# EAGLE schematic scratchpad (EAGLE 7.2.0)
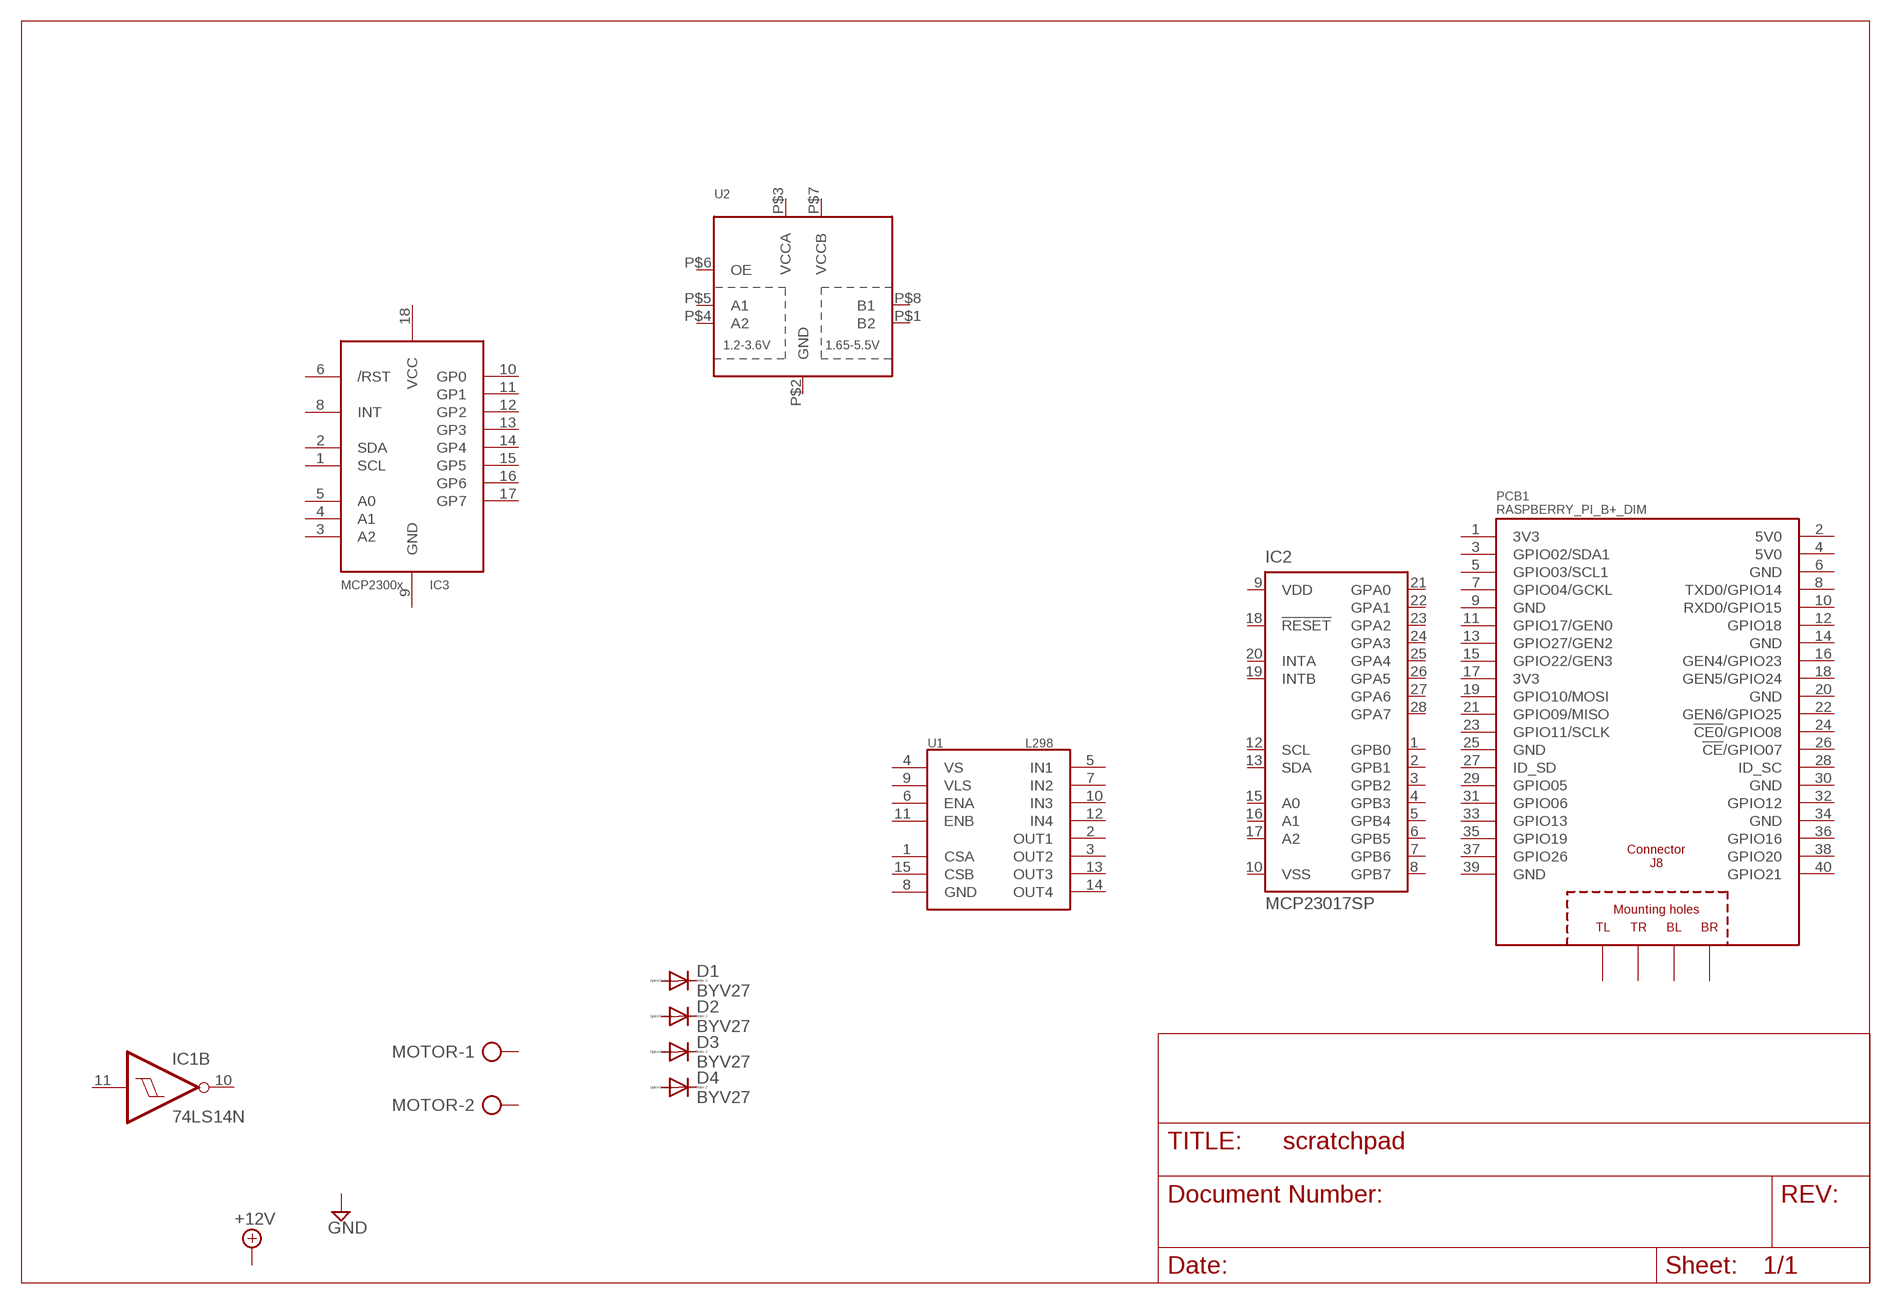
[diagram p0: schematic, sheet 1]

## Parts
D1  BYV27  [SOD57-10]
D2  BYV27  [SOD57-10]
D3  BYV27  [SOD57-10]
D4  BYV27  [SOD57-10]
IC1  74LS14N  [DIL14]
IC2  MCP23017SP  [DIL28-3]
IC3  MCP2300X/P  [DIL18]
MOTOR  AK500/2-H  [AK500/2-H]
PCB1  RASPBERRY_PI_B+_DIM  [RASPBERRY_PI_BPLUS_DIM]
U1  L298  [MULTIWATT15]
U2  TXS0102  [VFSOP-8]
Unconnected: D1.A D1.C D2.A D2.C D3.A D3.C D4.A D4.C IC1.1(D:I) IC1.2(D:O) IC1.3(E:I) IC1.4(E:O) IC1.5(F:I) IC1.6(F:O) IC1.8(C:O) IC1.9(C:I) IC1.10(B:O) IC1.11(B:I) IC1.12(A:O) IC1.13(A:I) IC2.1(GPB0) IC2.2(GPB1) IC2.3(GPB2) IC2.4(GPB3) IC2.5(GPB4) IC2.6(GPB5) IC2.7(GPB6) IC2.8(GPB7) IC2.12(SCL) IC2.13(SDA) IC2.15(A0) IC2.16(A1) IC2.17(A2) IC2.18(!RESET) IC2.19(INTB) IC2.20(INTA) IC2.21(GPA0) IC2.22(GPA1) IC2.23(GPA2) IC2.24(GPA3) IC2.25(GPA4) IC2.26(GPA5) IC2.27(GPA6) IC2.28(GPA7) IC3.1(SCL) IC3.2(SDA) IC3.3(A2) IC3.4(A1) IC3.5(A0) IC3.6(/RST) IC3.8(INT) IC3.10(GP0) IC3.11(GP1) IC3.12(GP2) IC3.13(GP3) IC3.14(GP4) IC3.15(GP5) IC3.16(GP6) IC3.17(GP7) MOTOR.1 MOTOR.2 PCB1.3(GPIO02/SDA1) PCB1.5(GPIO03/SCL1) PCB1.7(GPIO04/GCKL) PCB1.8(TXD0/GPIO14) PCB1.10(RXD0/GPIO15) PCB1.11(GPIO17/GEN0) PCB1.12(GPIO18) PCB1.13(GPIO27/GEN2) PCB1.15(GPIO22/GEN3) PCB1.16(GEN4/GPIO23) PCB1.18(GEN5/GPIO24) PCB1.19(GPIO10/MOSI) PCB1.21(GPIO09/MISO) PCB1.22(GEN6/GPIO25) PCB1.23(GPIO11/SCLK) PCB1.24(!CE0!/GPIO08) PCB1.26(!CE!/GPIO07) PCB1.27(ID_SD) PCB1.28(ID_SC) PCB1.29(GPIO05) PCB1.31(GPIO06) PCB1.32(GPIO12) PCB1.33(GPIO13) PCB1.35(GPIO19) PCB1.36(GPIO16) PCB1.37(GPIO26) PCB1.38(GPIO20) PCB1.40(GPIO21) PCB1.PE_BL(BL) PCB1.PE_BR(BR) PCB1.PE_TL(TL) PCB1.PE_TR(TR) U1.1(CSA) U1.2(OUT1) U1.3(OUT2) U1.4(VS) U1.5(IN1) U1.6(ENA) U1.7(IN2) U1.8(GND) U1.9(VLS) U1.10(IN3) U1.11(ENB) U1.12(IN4) U1.13(OUT3) U1.14(OUT4) U1.15(CSB) U2.P$1(B2) U2.P$2(GND) U2.P$3(VCCA) U2.P$4(A2) U2.P$5(A1) U2.P$6(OE) U2.P$7(VCCB) U2.P$8(B1)

## Power pins joined to a net without a drawn wire
3V3: PCB1.1(3V3) PCB1.17(3V3)
5V0: PCB1.2(5V0) PCB1.4(5V0)
GND: IC1.7(P:GND) IC3.9(GND) PCB1.6(GND) PCB1.9(GND) PCB1.14(GND) PCB1.20(GND) PCB1.25(GND) PCB1.30(GND) PCB1.34(GND) PCB1.39(GND)
VCC: IC1.14(P:VCC) IC3.18(VCC)
VDD: IC2.9(VDD)
VSS: IC2.10(VSS)

## Library data of the parts
D1-D4 = diode:BYV27: DIODE ultra fast
IC1 = 74xx-eu:74*14: Hex schmitt trigger INVERTER
IC2 = microchip:MCP23017: http://ww1.microchip.com/downloads/en/DeviceDoc/21952a.pdf Source: http://ww1.microchip.com/downloads/en/DeviceDoc/21952a.pdf; MF: MICROCHIP; MPN: MCP23017-E/SP; OC_FARNELL: 1332088; OC_NEWARK: 31K2959
IC3 = adafruit:MCP2300X: MCP23008 Inexpensive i2c i/o expander - 8 general purpose i/o pins with optional pullups
MOTOR = con-ptr500:AK500/2-H: CONNECTOR Aug. 2004 / PTR Meßtechnik: Die Bezeichnung der Serie AK505 wurde geändert. Es handelt sich hierbei um AK500 in horizontaler Ausführung.; OC_FARNELL: unknown; OC_NEWARK: unknown
PCB1 = RASPBERRY_PI_Bplus:RASPBERRY_PI_B+: Raspberry Pi B+ Basedon issue: Thursday, July 10, 2014 - Rev 1.2 LBR by Tim Rettmann 07-2014
U1 = SparkFun-PowerIC:L298: L298 Dual Full Bridge Driver
U2 = adafruit:TXS0102: 2-Bit Bi-Directional Level Shifter (I2C, etc.) Designed for I2C devices and has internal pullups. Not to be confused with TXB010x series. 1.2V-3.6V (VCCA) to 1.65V-5.5V (VCCB) bi-directional level shifter with auto direction sensing. Max data rate - 24Mbps (Push Pull), 2Mbps (Open Drain) Digikey: 296-21931-1-ND